# EAGLE schematic detector-discrete (EAGLE 7.6.0)
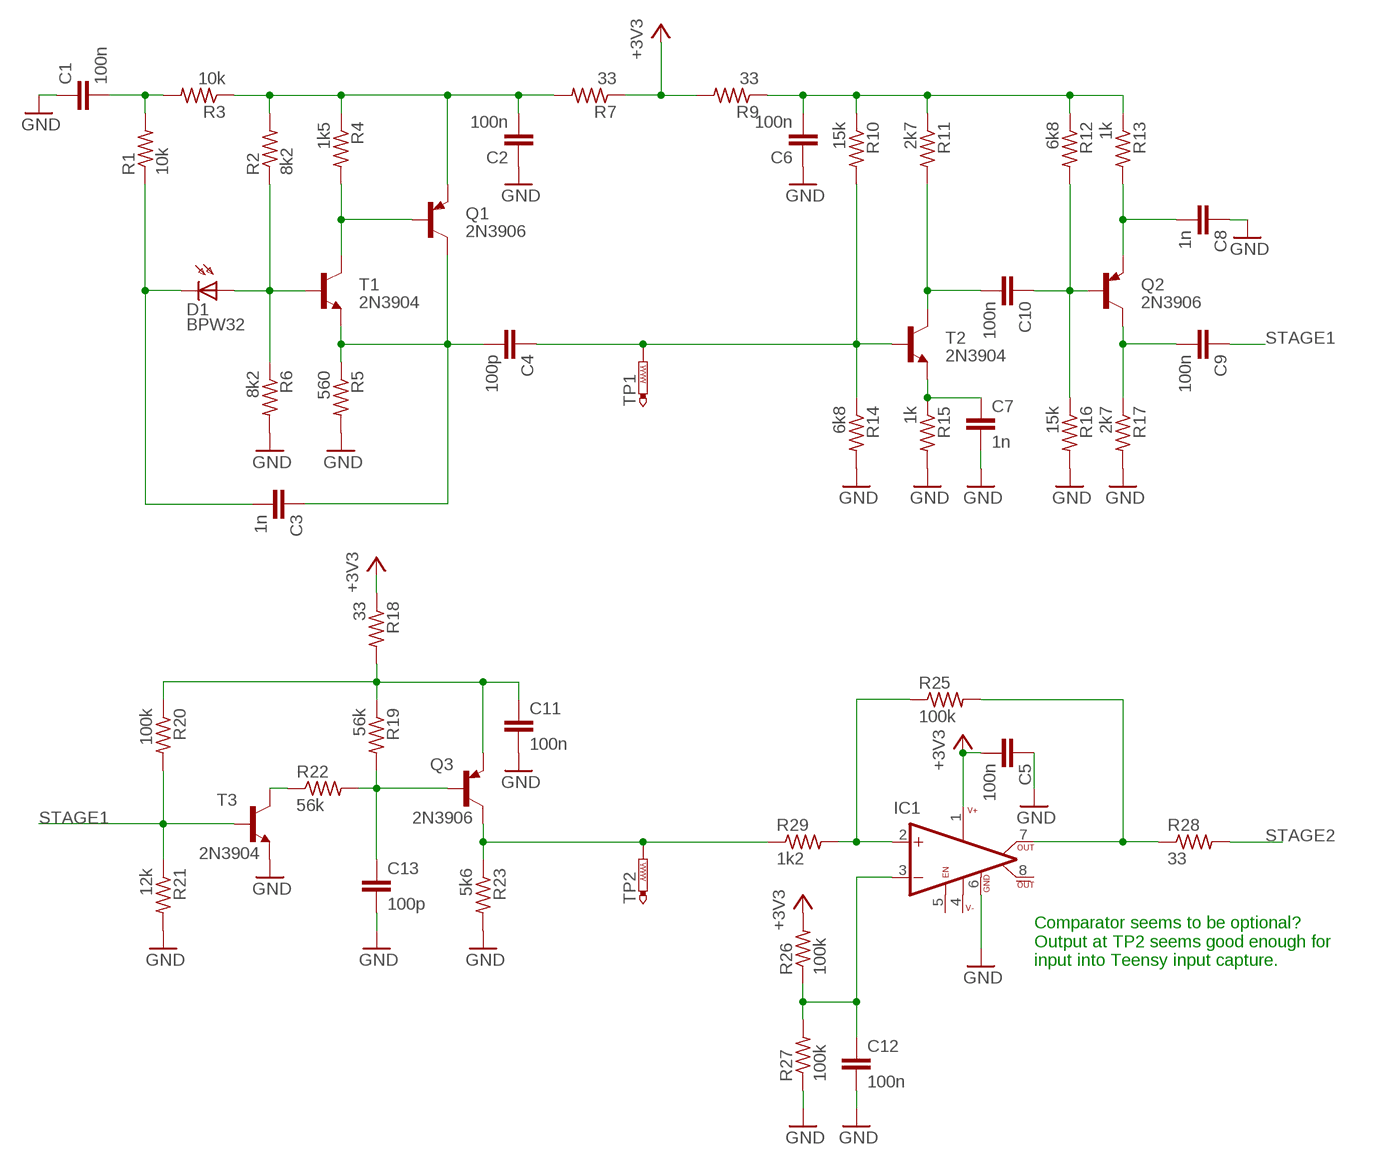
[diagram p0: schematic, sheet 1]

## Parts
C1  100n  C2,5-3  [C2.5-3]
C2  100n  C2,5-3  [C2.5-3]
C3  1n  C2,5-3  [C2.5-3]
C4  100p  C2,5-3  [C2.5-3]
C5  100n  C2,5-3  [C2.5-3]
C6  100n  C2,5-3  [C2.5-3]
C7  1n  C2,5-3  [C2.5-3]
C8  1n  C2,5-3  [C2.5-3]
C9  100n  C2,5-3  [C2.5-3]
C10  100n  C2,5-3  [C2.5-3]
C11  100n  C2,5-3  [C2.5-3]
C12  100n  C2,5-3  [C2.5-3]
C13  100p  C2,5-3  [C2.5-3]
D1  BPW32  [BPW32]
IC1  LT1016CN  [DIL08]
Q1  2N3906  [TO92]
Q2  2N3906  [TO92]
Q3  2N3906  [TO92]
R1  10k  R-US_0204/2V  [0204V]
R2  8k2  R-US_0204/2V  [0204V]
R3  10k  R-US_0204/2V  [0204V]
R4  1k5  R-US_0204/2V  [0204V]
R5  560  R-US_0204/2V  [0204V]
R6  8k2  R-US_0204/2V  [0204V]
R7  33  R-US_0204/2V  [0204V]
R9  33  R-US_0204/2V  [0204V]
R10  15k  R-US_0204/2V  [0204V]
R11  2k7  R-US_0204/2V  [0204V]
R12  6k8  R-US_0204/2V  [0204V]
R13  1k  R-US_0204/2V  [0204V]
R14  6k8  R-US_0204/2V  [0204V]
R15  1k  R-US_0204/2V  [0204V]
R16  15k  R-US_0204/2V  [0204V]
R17  2k7  R-US_0204/2V  [0204V]
R18  33  R-US_0204/2V  [0204V]
R19  56k  R-US_0204/2V  [0204V]
R20  100k  R-US_0204/2V  [0204V]
R21  12k  R-US_0204/2V  [0204V]
R22  56k  R-US_0204/2V  [0204V]
R23  5k6  R-US_0204/2V  [0204V]
R25  100k  R-US_0204/2V  [0204V]
R26  100k  R-US_0204/2V  [0204V]
R27  100k  R-US_0204/2V  [0204V]
R28  33  R-US_0204/2V  [0204V]
R29  1k2  R-US_0204/2V  [0204V]
T1  2N3904  [TO92]
T2  2N3904  [TO92]
T3  2N3904  [TO92]
TP1  PTR1B1,27  [B1,27]
TP2  PTR1B1,27  [B1,27]

## Nets
+3V3: C5.2 IC1.1(V+) R7.1 R9.2 R18.1 R26.2
GND: C1.1 C2.1 C5.1 C6.1 C7.2 C8.1 C11.2 C12.2 C13.2 IC1.6(GND) R5.2 R6.2 R14.2 R15.2 R16.2 R17.2 R21.2 R23.2 R27.1 T3.3(E)
N$1: C3.2 D1.K(C) R1.1
N$2: C1.2 R1.2 R3.2
N$3: D1.A R2.1 R6.1 T1.2(B)
N$4: C3.1 C4.2 Q1.1(C) R5.1 T1.3(E)
N$5: Q1.2(B) R4.2 T1.1(C)
N$6: C2.2 Q1.3(E) R2.2 R3.1 R4.1 R7.2
N$7: C6.2 R9.1 R10.1 R11.1 R12.1 R13.1
N$8: C10.1 Q2.2(B) R12.2 R16.1
N$9: C8.2 Q2.3(E) R13.2
N$10: C9.2 Q2.1(C) R17.1
N$11: C11.1 Q3.3(E) R18.2 R19.1 R20.1
N$12: C10.2 R11.2 T2.1(C)
N$13: C7.1 R15.1 T2.3(E)
N$14: C4.1 R10.2 R14.1 T2.2(B) TP1.TP
N$16: C13.1 Q3.2(B) R19.2 R22.2
N$17: R22.1 T3.1(C)
N$18: Q3.1(C) R23.1 R29.1 TP2.TP
N$19: C12.1 IC1.3(-IN) R26.1 R27.2
N$20: IC1.2(+IN) R25.1 R29.2
N$22: IC1.7(OUT) R25.2 R28.1
STAGE1: C9.1 R20.2 R21.1 T3.2(B)
STAGE2: R28.2
Unconnected: IC1.5(LA_EN) IC1.8(!OUT)

## Notes on the sheet
- Comparator seems to be optional?
  Output at TP2 seems good enough for
  input into Teensy input capture.

## Power pins joined to a net without a drawn wire
V-: IC1.4(V-)

## Library data of the parts
C1-C13 = capacitor-wima:C: CAPACITOR naming: grid - package width
D1 = opto-trans-siemens:BPW32: PHOTO DIODE; OC_FARNELL: unknown; OC_NEWARK: unknown
IC1 = linear-technology:LT1016: Ultra-fast precision COMPARATOR; MPN: LT1016CN8; OC_FARNELL: 9559353; OC_NEWARK: 57M0852
Q1-Q3 = transistor-pnp:2N3906: PNP Transistor
R1-R7 R9-R23 R25-R29 = resistor:R-US_: RESISTOR, American symbol
T1-T3 = transistor:2N3904: NPN TRANSISTOR
TP1 TP2 = testpad:PTR1: TEST PIN